# EAGLE design SolarLipoCharger_v01 (EAGLE 5.11)
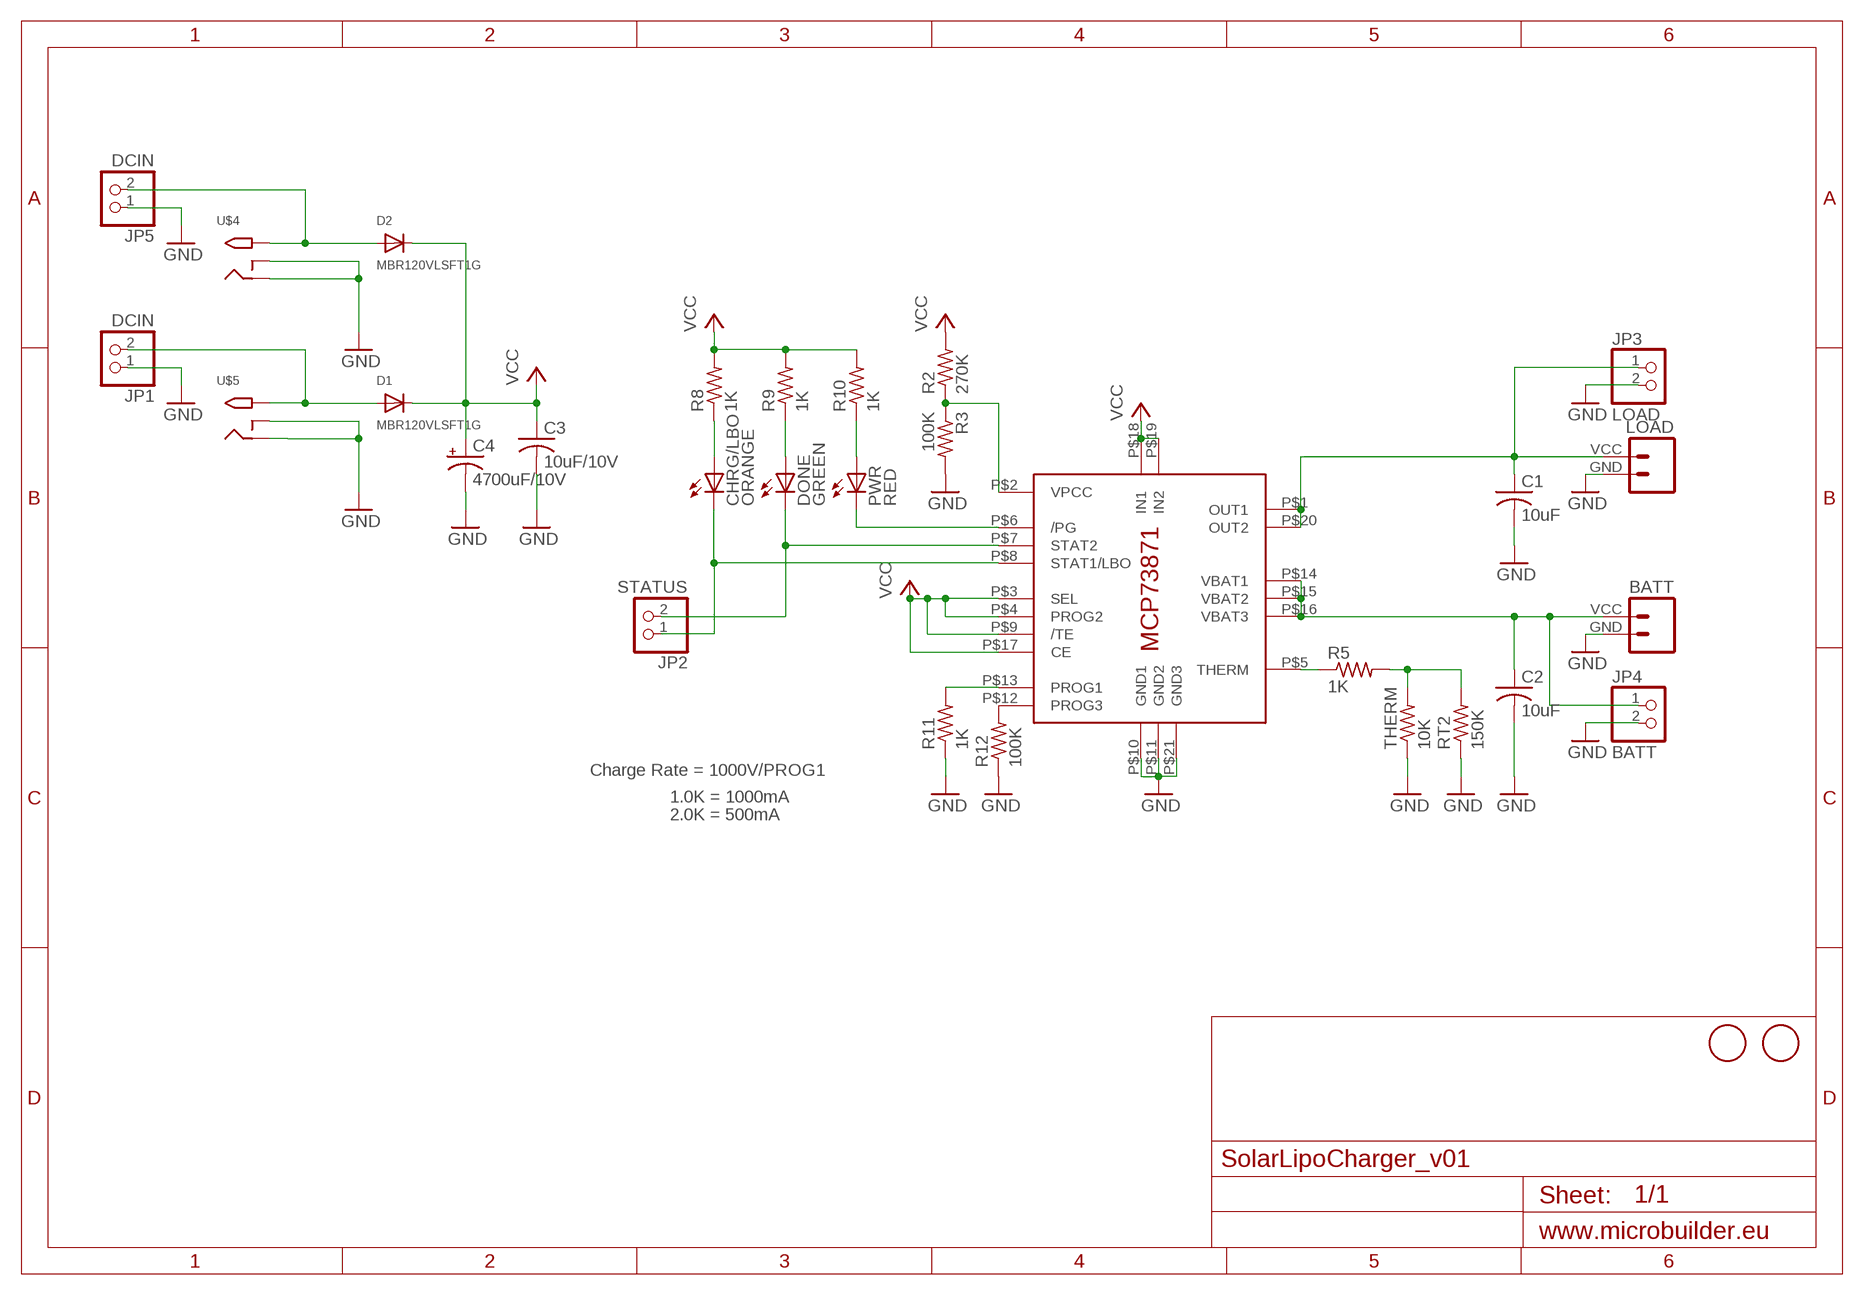
[diagram p0: schematic, sheet 1]

## Parts
BATT  M024UCON-15767  [JST-2-SMD-VERT]
C1  10uF  C-USC0805K  [C0805K]
C2  10uF  C-USC0805K  [C0805K]
C3  10uF/10V  C-USC0805K  [C0805K]
C4  4700uF/10V  CPOL-USE5-13  [E5-13]
CHRG/LBO  ORANGE  LEDCHIP-LED0805  [CHIP-LED0805]
D1  MBR120VLSFT1G  DIODESOD-123  [SOD-123]
D2  MBR120VLSFT1G  DIODESOD-123  [SOD-123]
DONE  GREEN  LEDCHIP-LED0805  [CHIP-LED0805]
IC1  MCP73871  [QFN20_4MM]
JP1  DCIN  HEADER-1X2  [1X02_OVAL]
JP2  STATUS  HEADER-1X2  [1X02_OVAL]
JP3  LOAD  HEADER-1X2  [1X02_OVAL]
JP4  BATT  HEADER-1X2  [1X02_OVAL]
JP5  DCIN  HEADER-1X2  [1X02_OVAL]
LOAD  M024UCON-15767  [JST-2-SMD-VERT]
PWR  RED  LEDCHIP-LED0805  [CHIP-LED0805]
R2  270K  R-US_R0805  [R0805]
R3  100K  R-US_R0805  [R0805]
R5  1K  R-US_M0805  [M0805]
R8  1K  R-US_R0805  [R0805]
R9  1K  R-US_R0805  [R0805]
R10  1K  R-US_R0805  [R0805]
R11  1K  R-US_R0805  [R0805]
R12  100K  R-US_R0805  [R0805]
RT2  150K  R-US_M0805  [M0805]
THERM  10K  R-US_FLIPFLOP  [0805-THM]
U$2  FIDUCIAL  [FIDUCIAL_1MM]
U$3  FIDUCIAL  [FIDUCIAL_1MM]
U$4  2.1MMJACKTHM  [PJ-102A]
U$5  2.1MMJACKTHM  [PJ-102A]

## Nets
BATT: BATT.VCC C2.1 IC1.P$14(VBAT1) IC1.P$15(VBAT2) IC1.P$16(VBAT3) JP4.1
GND: BATT.GND C1.2 C2.2 C3.2 C4.- IC1.P$10(GND1) IC1.P$11(GND2) IC1.P$21(GND3) JP1.1 JP3.2 JP4.2 JP5.1 LOAD.GND R3.2 R11.1 R12.1 RT2.1 THERM.1 U$4.RING U$4.RING_SW U$5.RING U$5.RING_SW
N$1: IC1.P$6(/PG) PWR.C
N$2: D2.A JP5.2 U$4.TIP
N$4: DONE.C IC1.P$7(STAT2) JP2.2
N$5: IC1.P$5(THERM) R5.1
N$6: IC1.P$2(VPCC) R2.1 R3.1
N$7: C1.1 IC1.P$1(OUT1) IC1.P$20(OUT2) JP3.1 LOAD.VCC
N$8: R5.2 RT2.2 THERM.2
N$10: D1.A JP1.2 U$5.TIP
N$11: CHRG/LBO.C IC1.P$8(STAT1/LBO) JP2.1
N$12: CHRG/LBO.A R8.1
N$13: DONE.A R9.1
N$14: PWR.A R10.1
N$15: IC1.P$12(PROG3) R12.2
N$16: IC1.P$13(PROG1) R11.2
VCC: C3.1 C4.+ D1.C D2.C IC1.P$3(SEL) IC1.P$4(PROG2) IC1.P$9(/TE) IC1.P$17(CE) IC1.P$18(IN1) IC1.P$19(IN2) R2.2 R8.2 R9.2 R10.2

## Notes on the sheet
- Charge Rate = 1000V/PROG1
- 1.0K = 1000mA
- 2.0K = 500mA

## Library data of the parts
BATT LOAD = SparkFun:M02: Header 2 Standard 2-pin 0.1" header. Use with straight break away headers (SKU : PRT-00116), right angle break away headers (PRT-00553), swiss pins (PRT-00743), machine pins (PRT-00117), and female headers (PRT-00115). Molex polarized connector foot print use with SKU : PRT-08233 with associated crimp pins and housings.
C1-C3 = adafruit:C-US: CAPACITOR, American symbol
C4 = adafruit:CPOL-US: POLARIZED CAPACITOR, American symbol
CHRG/LBO DONE PWR = adafruit:LED: LED OSRAM: - CHIPLED LG R971, LG N971, LY N971, LG Q971, LY Q971, LO R971, LY R971 LH N974, LH R974 LS Q976, LO Q976, LY Q976 LO Q996 - Hyper CHIPLED LW Q18S LB Q993, LB Q99A, LB R99A - SideLED LS A670, LO A670, LY A670, LG A670, LP A670 LB A673, LV A673, LT A673, LW A673 LH A674 LY A675 LS A676, LA A676, LO A676, LY A676, LW A676 LS A679, LY A679, LG A679 - Hyper Micro SIDELED® LS Y876, LA Y876, LO Y876, LY Y876 LT Y87S - SmartLED LW L88C, LW L88S LB L89C, LB L89S, LG L890 LS L89K, LO L89K, LY L89K LS L896, LA L896, LO L896, LY L896 - TOPLED LS T670, LO T670, LY T670, LG T670, LP T670 LSG T670, LSP T670, LSY T670, LOP T670, LYG T670 LG T671, LOG T671, LSG T671 LB T673, LV T673, LT T673, LW T673 LH T674 LS T676, LA T676, LO T676, LY T676, LB T676, LH T676, LSB T676, LW T676 LB T67C, LV T67C, LT T67C, LS T67K, LO T67K, LY T67K, LW E67C LS E67B, LA E67B, LO E67B, LY E67B, LB E67C, LV E67C, LT E67C LW T67C LS T679, LY T679, LG T679 LS T770, LO T770, LY T770, LG T770, LP T770 LB T773, LV T773, LT T773, LW T773 LH T774 LS E675, LA E675, LY E675, LS T675 LS T776, LA T776, LO T776, LY T776, LB T776 LHGB T686 LT T68C, LB T68C - Hyper Mini TOPLED® LB M676 - Mini TOPLED Santana® LG M470 LS M47K, LO M47K, LY M47K Source: http://www.osram.convergy.de/
D1 D2 = microbuilder:DIODE: Diode SMADIODE - SMA Surface Mount Package 20V 1A Schottky Diode Digikey (500mV @ 1A, 500uA Vr @ 20V): 641-1014-6-ND SOD-123 30V 500mA (430mV Vf, 130uA Vr @ 30V) Schottky Diode - Digikey: B0530W-FDICT-ND SOD-323 10V 570mA (380mV Vf, 3ns) Schottky Diode - Digikey: ZLLS410CT-ND 1N4148WS - 75V 150mA (1V Vf @ 10mA, 4ns) Simple Diode - Digikey: 1N4148WSFSCT-ND, Mouser: 512-1N4148WS SOD-523 30V 30mA Schottky Diode (RB751S-40TE61) - Digikey: RB751S-40TE61CT-ND SOT23-R/W - SOT23 Package (R = Solder Paste/Reflow Ovens, W = Hand-Soldering) BAT54Film 40V 300mA - Digikey: 497-7162-1-ND DO-1N4148 Through Hole Small Current Diode (any model)
IC1 = adafruit:MCP73871
JP1-JP5 = microbuilder:HEADER-1X2: PIN HEADER
R2 R3 R5 R8-R12 RT2 THERM = adafruit:R-US_: RESISTOR, American symbol
U$2 U$3 = adafruit:FIDUCIAL: For use by pick and place machines to calibrate the vision/machine, 1mm By microbuilder.eu
U$4 U$5 = adafruit:2.1MMJACK: 2.1mm x 5.5mm THM DC jack with internal switch. Digikey part #PJ-102A, 4UCON part #05537 2.1mm x 5.5mm SMT DC jack with internal switch. Digikey part #PJ-002A-SMT, 4UCON part #03267 By microbuilder.eu & adafruit.com

## Board
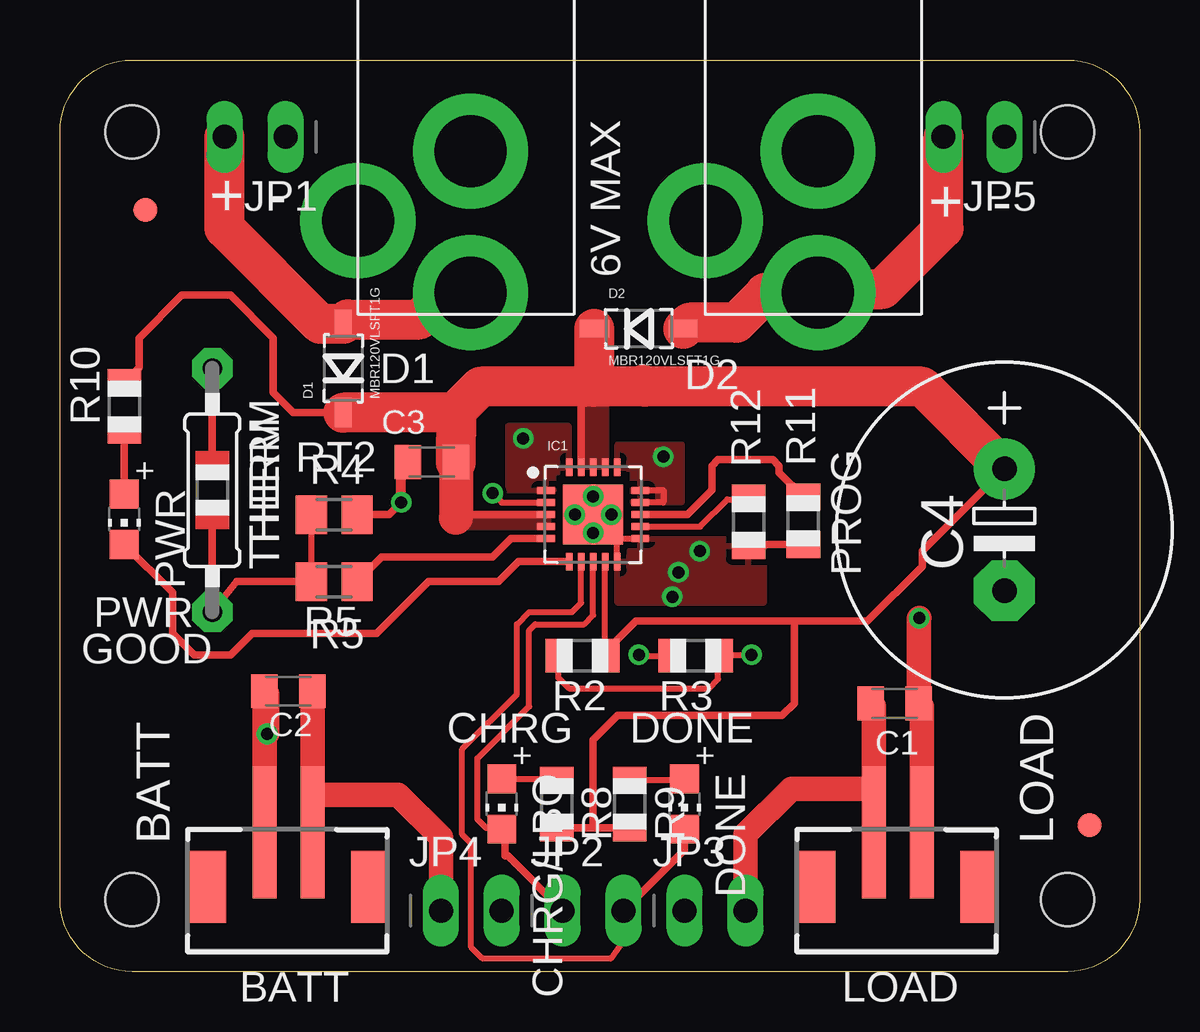
[diagram p1: board, top side]
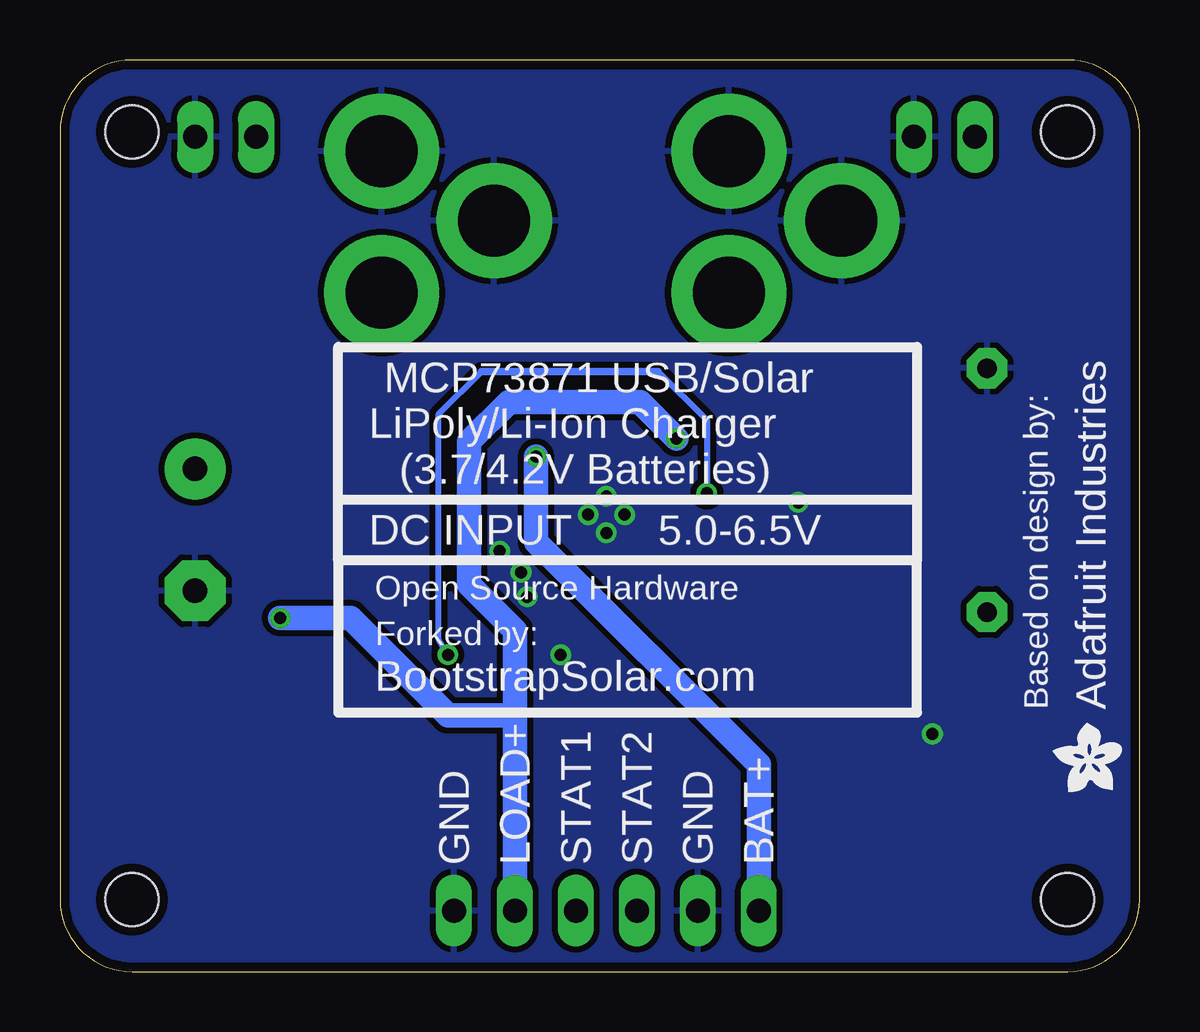
[diagram p2: board, bottom side, seen from below]

Size 45 x 38 mm. Coordinates in mm from the lower left corner, seen from the top.
Outline: 0,3 0,35 arc-90 3,38 42,38 arc-90 45,35 45,3 arc-90 42,0 3,0 arc-90 0,3
Copper layers (1*16): Top 0.0356mm / dielectric 1.5011mm / Bottom 0.0356mm
Design rules "LaenPCBOrder": minimum track width 6mil, minimum drill 13mil, track to track 6mil, track to pad 6mil, pad to pad 6mil, via to via 6mil, smd to smd 6mil, copper to edge 15mil, drill to drill 6mil, minimum pad ring 7mil, minimum via ring 7mil, stop-mask expansion 4mil, vias tented up to drill 0mil, thermal gap 10mil
Holes 2.2 mm at 3,35 3,3 42,3 42,35
tRestrict: 1 lines

### Footprints (pad centres in the part's own frame; a part is rotated, then mirrored left to right if it is on the bottom)
JST-2-SMD-VERT = smd 1 x 5.5: GND 1,-2; VCC -1,-2 | smd 1.6 x 3: P$1 -3.4,0.27; P$2 3.4,0.27
C0805K = smd 1.1 x 1.4: 1 -1,0; 2 1,0
E5-13 = drill 1.016 pad 2.54 round: + -2.54,0 | drill 1.016 pad 2.54 octagon: - 2.54,0
CHIP-LED0805 = smd 1.2 x 1.2: A 0,-1.05; C 0,1.05
SOD-123 = smd 1.2 x 0.7: A 1.85,0; C -1.85,0
QFN20_4MM = smd 0.73 x 0.28: P$1 -1.965,1; P$2 -1.965,0.5; P$3 -1.965,0; P$4 -1.965,-0.5; P$5 -1.965,-1; P$11 1.965,-1; P$12 1.965,-0.5; P$13 1.965,0; P$14 1.965,0.5; P$15 1.965,1 | smd 0.28 x 0.73: P$6 -1,-1.965; P$7 -0.5,-1.965; P$8 0,-1.965; P$9 0.5,-1.965; P$10 1,-1.965; P$16 1,1.965; P$17 0.5,1.965; P$18 0,1.965; P$19 -0.5,1.965; P$20 -1,1.965 | smd 2.5 x 2.5: P$21 0,0
1X02_OVAL = drill 1 long: 1 -1.27,0; 2 1.27,0
R0805 = smd 1.1 x 1.4: 1 -1,0; 2 1,0
M0805 = smd 1.3 x 1.6: 1 -0.95,0; 2 0.95,0
0805-THM = drill 0.813 pad 1.676 octagon: 1 -5.08,0; 2 5.08,0
FIDUCIAL_1MM = smd 1 x 1: 1 0,0
PJ-102A = drill 3 pad 4.8 round: RING 0.1,-3.39; RING_SW -4.6,-6.29; TIP 0.1,-9.29

### Placement (x,y rotation side)
BATT  9.53,3.81 180 top
C1  34.8,11.18 180 top
C2  9.53,11.68 180 top
C3  15.49,21.24 180 top
C4  39.37,18.41 270 top
CHRG/LBO  18.41,6.99 180 top
D1  11.81,25.15 90 top
D2  24.13,26.8 0 top
DONE  26.04,6.99 180 top
IC1  22.23,19.05 0 top
JP1  8.13,34.8 180 top
JP2  22.23,2.54 0 top
JP3  27.3,2.54 0 top
JP4  17.14,2.54 0 top
JP5  38.1,34.8 180 top
LOAD  34.92,3.81 180 top
PWR  2.68,18.86 180 top
R2  21.78,13.16 0 top
R3  26.5,13.16 180 top
R5  11.43,16.26 180 top
R8  20.7,6.99 270 top
R9  23.75,6.99 270 top
R10  2.68,23.56 90 top
R11  30.99,18.8 90 top
R12  28.7,18.75 90 top
RT2  11.43,19.05 180 top
THERM  6.35,20.07 270 top
U$1  [ADAFRUIT200MIL]  2.29,8.89 0 bottom
U$2  3.56,31.75 0 top
U$3  42.93,6.1 0 top
U$4  31.5,37.59 0 top
U$5  17.02,37.59 0 top

### Tracks (layer width: path | path; a pad name or v marks a point on that pad's centre or on a via)
BATT  (via drill 0.5)
  Top 0.254: v25.15,21.46 24.89,21.72 | IC1.P$14 25.14,19.55 25.15,19.56 25.15,20.07 24.21,20.07 IC1.P$15
  Top 1.016: C2.1 BATT.VCC 10.53,7.22 10.67,7.37 14.1,7.37 15.88,5.59 JP4.1
  Bottom 1.016: JP4.1 15.88,8.64 25.15,17.91 v25.15,21.46
  pour Top: 23.24,20.95 23.24,21.97 25.91,21.97 25.91,19.56 23.88,19.56 23.88,20.95
GND  (via drill 0.5)
  Top 0.254: v22.23,19.81 23.23,18.05 IC1.P$11 | IC1.P$10 23.23,18.02 23.24,18.03 | R3.2 24.18,13.16 v24.13,13.21
  Top 0.305: RT2.1 13.72,19.05 v14.22,19.56 | R11.1 28.75,17.8 R12.1
  Top 0.406: IC1.P$21 v22.99,19.05 | C3.2 14.22,21.24 v14.22,19.56
  Top 1.016: 33.92,7.62 LOAD.GND | 33.92,7.62 33.92,11.05 C1.2 | JP3.2 28.57,5.71 30.48,7.62 33.92,7.62 | BATT.GND C2.2 8.64,11.57 v8.64,9.91
  other vias: 25.53,15.62 25.78,16.64 26.67,17.53 22.23,18.29 21.46,19.05
  pour Bottom (isolate 0.254): 0,0 0,38 45,38 45,0
  pour Top: 23.24,18.03 29.34,18.03 29.34,15.37 23.24,15.37
N$1
  Top 0.305: IC1.P$6 19.12,17.09 18.29,16.26 15.37,16.26 13.21,14.1 8,14.1 7.11,13.21 5.59,13.21 4.7,14.1 4.7,15.79 PWR.C
N$2
  Top 1.676: JP5.2 36.83,30.99 34.29,28.45 31.74,28.45 U$4.TIP 29.39,28.3 29.39,28.25 28.19,27.05 26.23,27.05 D2.A
N$4
  Top 0.254: IC1.P$7 21.73,15.38 21.34,14.99 19.56,14.99 19.05,14.48 19.05,11.56 16.76,9.27 16.76,5.71 17.14,5.33 17.14,1.02 17.6,0.56 22.99,0.56 23.5,1.27 JP2.2
  Top 0.305: DONE.C 26.04,5.08 JP2.2
N$5
  Top 0.305: IC1.P$5 18.81,18.05 18.03,17.27 13.4,17.27 R5.1
N$6  (via drill 0.5)
  Top 0.254: IC1.P$2 18.42,19.55 v18.03,19.94 | R2.1 20.78,12.24 21.21,11.81 27.05,11.81 27.43,12.19 27.43,13.1 R3.1 27.54,13.21 v28.83,13.21
  Bottom 0.254: v18.03,19.94 18.03,22.99 20.07,25.02 | 27.43,25.02 29.21,23.24 29.21,13.84 v28.83,13.21
  Bottom 0.305: 27.43,25.02 20.07,25.02
N$7  (via drill 0.5)
  Top 1.016: v35.81,14.73 35.8,14.72 C1.1 35.92,11.05 LOAD.VCC
  Bottom 1.016: JP3.1 26.04,10.67 | 26.04,10.67 26.04,14.22 27.94,16.13 27.94,22.1 26.29,23.75 20.83,23.75 v19.3,22.23 | v35.81,14.73 32.89,14.73 28.83,10.67 26.04,10.67
  pour Top: 21.21,20.83 21.21,22.61 21.21,22.73 18.67,22.73 18.67,20.07 20.45,20.07 20.57,20.07 20.57,20.7 20.57,20.83
N$8
  Top 0.254: R5.2 RT2.2
  Top 0.305: R5.2 7.37,16.26 THERM.2
N$10
  Top 1.676: JP1.2 6.86,32.77 6.86,31.95 6.86,30.99 10.85,27 D1.A 11.99,27.18 14.99,27.18 16.11,28.3 U$5.TIP
N$11
  Top 0.254: IC1.P$8 22.23,14.86 21.84,14.48 19.81,14.48 19.56,14.22 19.56,11.05 17.4,8.89 17.4,6.35 17.78,5.97 18.38,5.97 CHRG/LBO.C 18.51,5.84
  Top 0.305: 18.51,5.84 18.54,5.84 18.54,4.83 18.67,4.83 JP2.1
N$12
  Top 0.254: CHRG/LBO.A 20.91,8.04 R8.1
N$13
  Top 0.254: R9.1 25.98,7.99 DONE.A
N$14
  Top 0.305: PWR.A R10.1
N$15
  Top 0.254: IC1.P$12 26.68,18.55 27.81,19.68 28.64,19.68 R12.2
N$16
  Top 0.305: IC1.P$13 26.16,19.05 27.18,20.07 27.18,21.08 27.43,21.34 29.72,21.34 29.97,21.08 29.97,20.81 R11.2
VCC
  Top 0.254: IC1.P$9 22.73,13.21 R2.2
  Top 0.305: D1.C 9.72,23.3 8.89,24.13 8.89,26.42 7.11,28.19 5.08,28.19 3.3,26.42 3.3,25.18 R10.2 | R8.2 R9.2 22.34,5.99 22.23,6.1 22.23,9.65 23.24,10.67 30.1,10.67 30.61,11.18 30.61,14.61 | R2.2 22.78,13.38 24,14.61 30.61,14.61 | 30.61,14.61 33.66,14.61 35.94,16.89 35.94,17.53 C4.+ | IC1.P$19 21.73,24.27 21.84,24.38 | IC1.P$3 16.64,19.05 16.51,18.92
  Top 1.422: 16.51,21.22 16.51,18.92
  Top 1.676: 16.51,23.37 C3.1 16.51,21.22 | 16.51,23.37 17.53,24.38 21.84,24.38 22.23,24.38 | 24.38,24.38 22.23,24.38 | 24.38,24.38 35.94,24.38 C4.+ | D1.C 16.44,23.3 16.51,23.37 | 24.38,24.38 24.31,24.46 | D2.C 22.28,24.44 22.23,24.38
  pour Top (no thermals): 22.73,21.08 21.72,21.08 21.72,24.89 22.73,24.89
  pour Top (no thermals): 20.32,19.05 16.26,19.05 16.26,18.54 20.32,18.54

### Text on the board
tPlace: + | - | + | - | 6V MAX | D1 | D2 | R4 | THERM | PROG | R5 | PWR | GOOD | CHRG | DONE | BATT | LOAD
bPlace: MCP73871 USB/Solar | LiPoly/Li-Ion Charger | (3.7/4.2V Batteries) | 5.0-6.5V | DC INPUT | Open Source Hardware | Forked by: | BootstrapSolar.com | Adafruit Industries | Based on design by: | BAT+ | GND | STAT2 | STAT1 | LOAD+ | GND